# Altium schematic sheet 3V3_Buck_Regulator.SchDoc
size A4; SheetNumber: 3; SheetTotal: 3
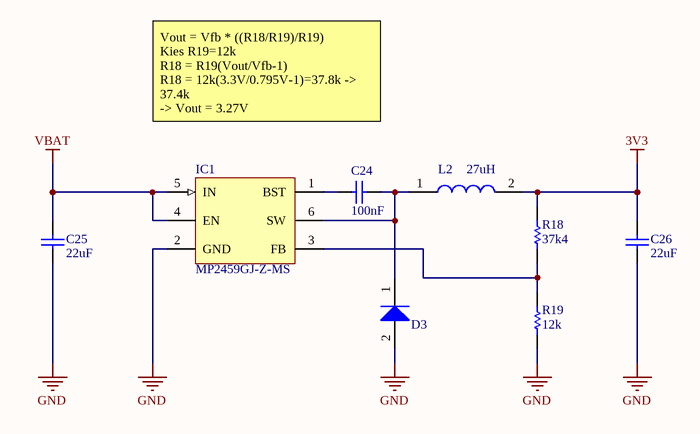
[diagram p0: 3V3_Buck_Regulator.SchDoc]

## Parts
C24  value 100nF  [Wurth 0603 capacitor]  (hidden comment: Generic Capacitor 100nF 0603)
C25  value 22uF  [Wurth 0805 capacitor]  (hidden comment: Generic Capacitor 22uF 0805)
C26  value 22uF  [Wurth 0805 capacitor]  (hidden comment: Generic Capacitor 22uF 0805)
D3  Diode RF071MM2STFTR  [Rohm SOD-123]  (value not drawn)
IC1  MP2459GJ-Z-MS  [Texas InstrumentsSOT95P280X110-6N]
L2  value 27uH  [3L COILS 5.2X5.8MM]  (hidden comment: COILS SMTDR54-270M)
R18  value 37k4  [Wurth 0603 Resistor]  (hidden comment: Generic Resistor 37k4 0603)
R19  value 12k  [Wurth 0603 Resistor]  (hidden comment: Generic Resistor 12k 0603)

## Nets
3V3: C26.2 L2.2 R18.2
GND: C25.1 C26.1 D3.2(A) IC1.2(GND) R19.1
VBAT: C25.2 IC1.4(EN) IC1.5(IN)
NetC24_1: C24.1 IC1.1(BST)
NetC24_2: C24.2 D3.1(K) IC1.6(SW) L2.1
NetIC1_3: IC1.3(FB) R18.1 R19.2

## Notes on the sheet
- Vout = Vfb * ((R18/R19)/R19)
  Kies R19=12k
  R18 = R19(Vout/Vfb-1)
  R18 = 12k(3.3V/0.795V-1)=37.8k -> 37.4k
  -> Vout = 3.27V

## Library data of the parts
IC1 = MSKSEMI MP2459GJ-Z-MS: Buck Converter 4.5V-60V 600mA
L2 = 3L COILS SMTDR54-270M inductor: Manufacturer: 3L Coils